# Altium schematic sheet EMMC_SD.SchDoc
size A3; SheetNumber: 6; SheetTotal: 20
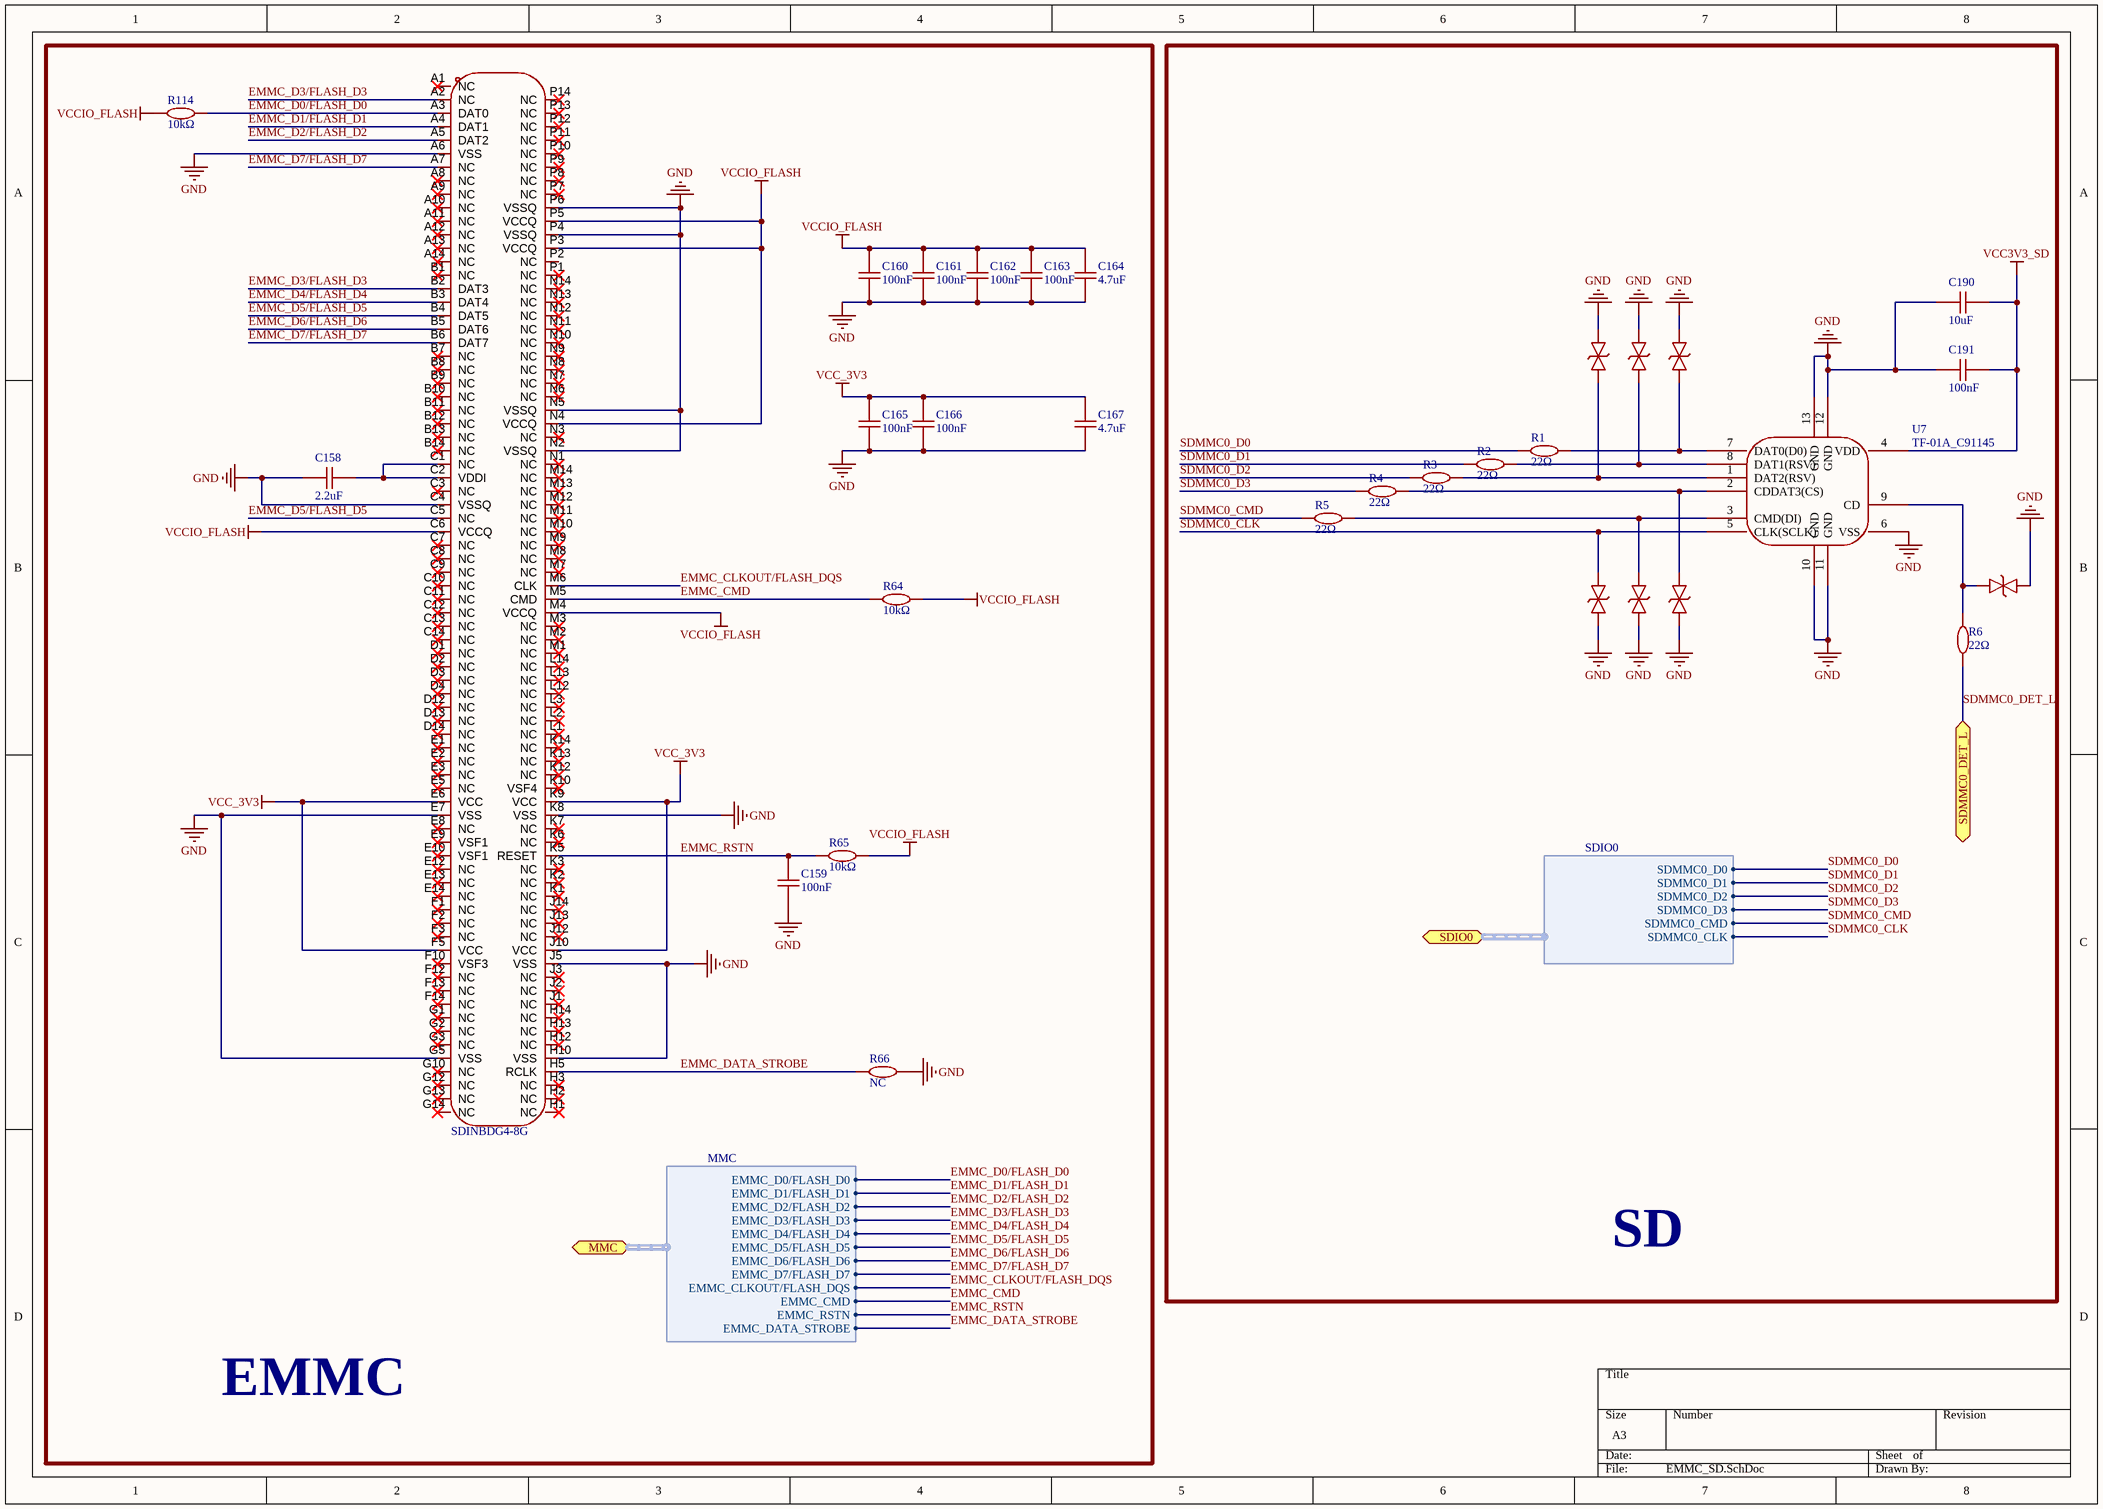
[diagram p0: EMMC_SD.SchDoc]

## Parts
C158  2.2uF  [C0402]
C159  100nF  [C0402]
C160  100nF  [C0402]
C161  100nF  [C0402]
C162  100nF  [C0402]
C163  100nF  [C0402]
C164  4.7uF  [C0402]
C165  100nF  [C0402]
C166  100nF  [C0402]
C167  4.7uF  [C0402]
C190  10uF  [C0603]
C191  100nF  [C0402]
R1  22Ω  [R0402]
R2  22Ω  [R0402]
R3  22Ω  [R0402]
R4  22Ω  [R0402]
R5  22Ω  [R0402]
R6  22Ω  [R0402]
R64  10kΩ  [R0402]
R65  10kΩ  [R0402]
R66  NC  [R0402]
R114  10kΩ  [R0402]
U3  SDINBDG4-8G  [FBGA-153_L13.0-W11.5-P0.50_KLMAG1JETD-B041]
U4  ESD5451N  [DFN1006-2L-BI]  (value not drawn)
U5  ESD5451N  [DFN1006-2L-BI]  (value not drawn)
U6  ESD5451N  [DFN1006-2L-BI]  (value not drawn)
U7  TF-01A_C91145  [TF-SMD_TF-01A]
U8  ESD5451N  [DFN1006-2L-BI]  (value not drawn)
U9  ESD5451N  [DFN1006-2L-BI]  (value not drawn)
U10  ESD5451N  [DFN1006-2L-BI]  (value not drawn)
U11  ESD5451N  [DFN1006-2L-BI]  (value not drawn)

## Blocks framed on the sheet
EMMC: C158-C167 R64-R66 R114 U3
SD: C190 C191 R1-R6 U4-U11

## Ports
MMC (bidir, harness MMC, see Overview[6B], RK3566[3B], RK3566_FLASH_SD_SARADC[1A]), SDIO0 (bidir, harness SDIO0, see Overview[6C], RK3566[3B], RK3566_FLASH_SD_SARADC[4A]), SDMMC0_DET_L (bidir, see Overview[6C], RK3566[3C], RK3566_OSC_PLL_PMUO1_2[3D])

## Harnesses
MMC: EMMC_D0/FLASH_D0, EMMC_D1/FLASH_D1, EMMC_D2/FLASH_D2, EMMC_D3/FLASH_D3, EMMC_D4/FLASH_D4, EMMC_D5/FLASH_D5, EMMC_D6/FLASH_D6, EMMC_D7/FLASH_D7, EMMC_CLKOUT/FLASH_DQS, EMMC_CMD, EMMC_RSTN, EMMC_DATA_STROBE
SDIO0: SDMMC0_D0, SDMMC0_D1, SDMMC0_D2, SDMMC0_D3, SDMMC0_CMD, SDMMC0_CLK

## Nets
GND: C158.1 C159.1 C160.1 C161.1 C162.1 C163.1 C164.1 C165.1 C166.1 C167.1 C190.1 C191.1 R66.2 U3.A6(VSS) U3.C4(VSSQ) U3.E7(VSS) U3.G5(VSS) U3.H10(VSS) U3.J5(VSS) U3.K8(VSS) U3.N2(VSSQ) U3.N5(VSSQ) U3.P4(VSSQ) U3.P6(VSSQ) U4.2 U5.2 U6.2 U7.6(VSS) U7.10(GND) U7.11(GND) U7.12(GND) U7.13(GND) U8.1 U9.1 U10.1 U11.1
VCC3V3_SD: C190.2 C191.2 U7.4(VDD)
VCC_3V3: C165.2 C166.2 C167.2 U3.E6(VCC) U3.F5(VCC) U3.J10(VCC) U3.K9(VCC)
VCCIO_FLASH: C160.2 C161.2 C162.2 C163.2 C164.2 R64.2 R65.2 R114.1 U3.C6(VCCQ) U3.M4(VCCQ) U3.N4(VCCQ) U3.P3(VCCQ) U3.P5(VCCQ)
EMMC_CLKOUT/FLASH_DQS: U3.M6(CLK) ; port MMC.EMMC_CLKOUT/FLASH_DQS
EMMC_CMD: R64.1 U3.M5(CMD) ; port MMC.EMMC_CMD
EMMC_D0/FLASH_D0: R114.2 U3.A3(DAT0) ; port MMC.EMMC_D0/FLASH_D0
EMMC_D1/FLASH_D1: U3.A4(DAT1) ; port MMC.EMMC_D1/FLASH_D1
EMMC_D2/FLASH_D2: U3.A5(DAT2) ; port MMC.EMMC_D2/FLASH_D2
EMMC_D3/FLASH_D3: U3.A2(NC) U3.B2(DAT3) ; port MMC.EMMC_D3/FLASH_D3
EMMC_D4/FLASH_D4: U3.B3(DAT4) ; port MMC.EMMC_D4/FLASH_D4
EMMC_D5/FLASH_D5: U3.B4(DAT5) U3.C5(NC) ; port MMC.EMMC_D5/FLASH_D5
EMMC_D6/FLASH_D6: U3.B5(DAT6) ; port MMC.EMMC_D6/FLASH_D6
EMMC_D7/FLASH_D7: U3.A7(NC) U3.B6(DAT7) ; port MMC.EMMC_D7/FLASH_D7
EMMC_DATA_STROBE: R66.1 U3.H5(RCLK) ; port MMC.EMMC_DATA_STROBE
EMMC_RSTN: C159.2 R65.1 U3.K5(RESET) ; port MMC.EMMC_RSTN
SDMMC0_CLK: U7.5(CLK(SCLK)) U8.2 ; port SDIO0.SDMMC0_CLK
SDMMC0_CMD: R5.1 ; port SDIO0.SDMMC0_CMD
SDMMC0_D0: R1.1 ; port SDIO0.SDMMC0_D0
SDMMC0_D1: R2.1 ; port SDIO0.SDMMC0_D1
SDMMC0_D2: R3.1 ; port SDIO0.SDMMC0_D2
SDMMC0_D3: R4.1 ; port SDIO0.SDMMC0_D3
SDMMC0_DET_L: R6.1 ; port SDMMC0_DET_L
NetC158_2: C158.2 U3.C1(NC) U3.C2(VDDI)
NetR1_2: R1.2 U6.1 U7.7(DAT0(D0))
NetR2_2: R2.2 U5.1 U7.8(DAT1(RSV))
NetR3_2: R3.2 U4.1 U7.1(DAT2(RSV))
NetR4_2: R4.2 U7.2(CDDAT3(CS)) U10.2
NetR5_2: R5.2 U7.3(CMD(DI)) U9.2
NetR6_2: R6.2 U7.9(CD) U11.2

Not connected (* = marked no-connect by the designer): U3 A1(NC)* A8(NC)* A9(NC)* A10(NC)* A11(NC)* A12(NC)* A13(NC)* A14(NC)* B1(NC)* B7(NC)* B8(NC)* B9(NC)* B10(NC)* B11(NC)* B12(NC)* B13(NC)* B14(NC)* C3(NC)* C7(NC)* C8(NC)* C9(NC)* C10(NC)* C11(NC)* C12(NC)* C13(NC)* C14(NC)* D1(NC)* D2(NC)* D3(NC)* D4(NC)* D12(NC)* D13(NC)* D14(NC)* E1(NC)* E2(NC)* E3(NC)* E5(NC)* E8(NC)* E9(VSF1)* E10(VSF1)* E12(NC)* E13(NC)* E14(NC)* F1(NC)* F2(NC)* F3(NC)* F10(VSF3)* F12(NC)* F13(NC)* F14(NC)* G1(NC)* G2(NC)* G3(NC)* G10(NC)* G12(NC)* G13(NC)* G14(NC)* H1(NC)* H2(NC)* H3(NC)* H12(NC)* H13(NC)* H14(NC)* J1(NC)* J2(NC)* J3(NC)* J12(NC)* J13(NC)* J14(NC)* K1(NC)* K2(NC)* K3(NC)* K6(NC)* K7(NC)* K10(VSF4)* K12(NC)* K13(NC)* K14(NC)* L1(NC)* L2(NC)* L3(NC)* L12(NC)* L13(NC)* L14(NC)* M1(NC)* M2(NC)* M3(NC)* M7(NC)* M8(NC)* M9(NC)* M10(NC)* M11(NC)* M12(NC)* M13(NC)* M14(NC)* N1(NC)* N3(NC)* N6(NC)* N7(NC)* N8(NC)* N9(NC)* N10(NC)* N11(NC)* N12(NC)* N13(NC)* N14(NC)* P1(NC)* P2(NC) P7(NC)* P8(NC)* P9(NC)* P10(NC)* P11(NC)* P12(NC)* P13(NC)* P14(NC)*

## Library data of the parts
C158 = 2.2uF: 50V 2.2uF NP0 0402 Ceramic Capacitors ROHS
C159-C163 C165 C166 C191 = 100nF: 50V 100nF X7R ±10% 0402 Ceramic Capacitors ROHS
C164 C167 = 4.7uF: 10V 4.7uF X5R ±20% 0402 Ceramic Capacitors ROHS
C190 = 10uF: 10V 10uF X5R ±10% 0603 Ceramic Capacitors ROHS
R1-R6 = 22Ω: 62.5mW 33Ω 50V ±100ppm/℃ Thick Film Resistor ±1% 0402 Chip Resistor - Surface Mount ROHS
R64-R66 R114 = 10kΩ: 62.5mW 10kΩ 50V ±100ppm/℃ Thick Film Resistor ±1% 0402 Chip Resistor - Surface Mount ROHS
U4-U6 U8-U11 = ESD5451N_C5261080: 9A 9.8V 8V Bidirectional 5V DFN1006-2L TVS Diodes ROHS; Manufacturer: HXY MOSFET(华轩阳电子); Add into BOM: yes; Reverse Leakage Current (Ir): 500nA; Number of Channels: 1.0; level of protection: IEC 61000-4-2; Junction Capacitance: 15pF; Symbol: ESD5451N_C5261080; Device: ESD5451N_C5261080; LCSC Part Name: 5V 15pF 双向; Supplier Part: C5261080; Manufacturer Part: ESD5451N; Supplier Footprint: DFN1006-2L; JLCPCB Part Class: Extended Part; Datasheet: https://item.szlcsc.com/datasheet/ESD5451N/5983779.html; Supplier: LCSC; Convert to PCB: yes; Polarity: Bidirectional; Reverse Stand-Off Voltage (Vrwm): 5V; Clamping Voltage: 9.8V; Peak Pulse Current (Ipp): 9A; Voltage - Breakdown: 8V; Type: ESD
U7 = TF-01A_C91145: Push-Push 1.85mm Connector and Ejector MicroSD Card (TF Card) SMD PC Card Sockets ROHS
U3 = SDINBDG4-8G: Symbol: SDINBDG4-8G